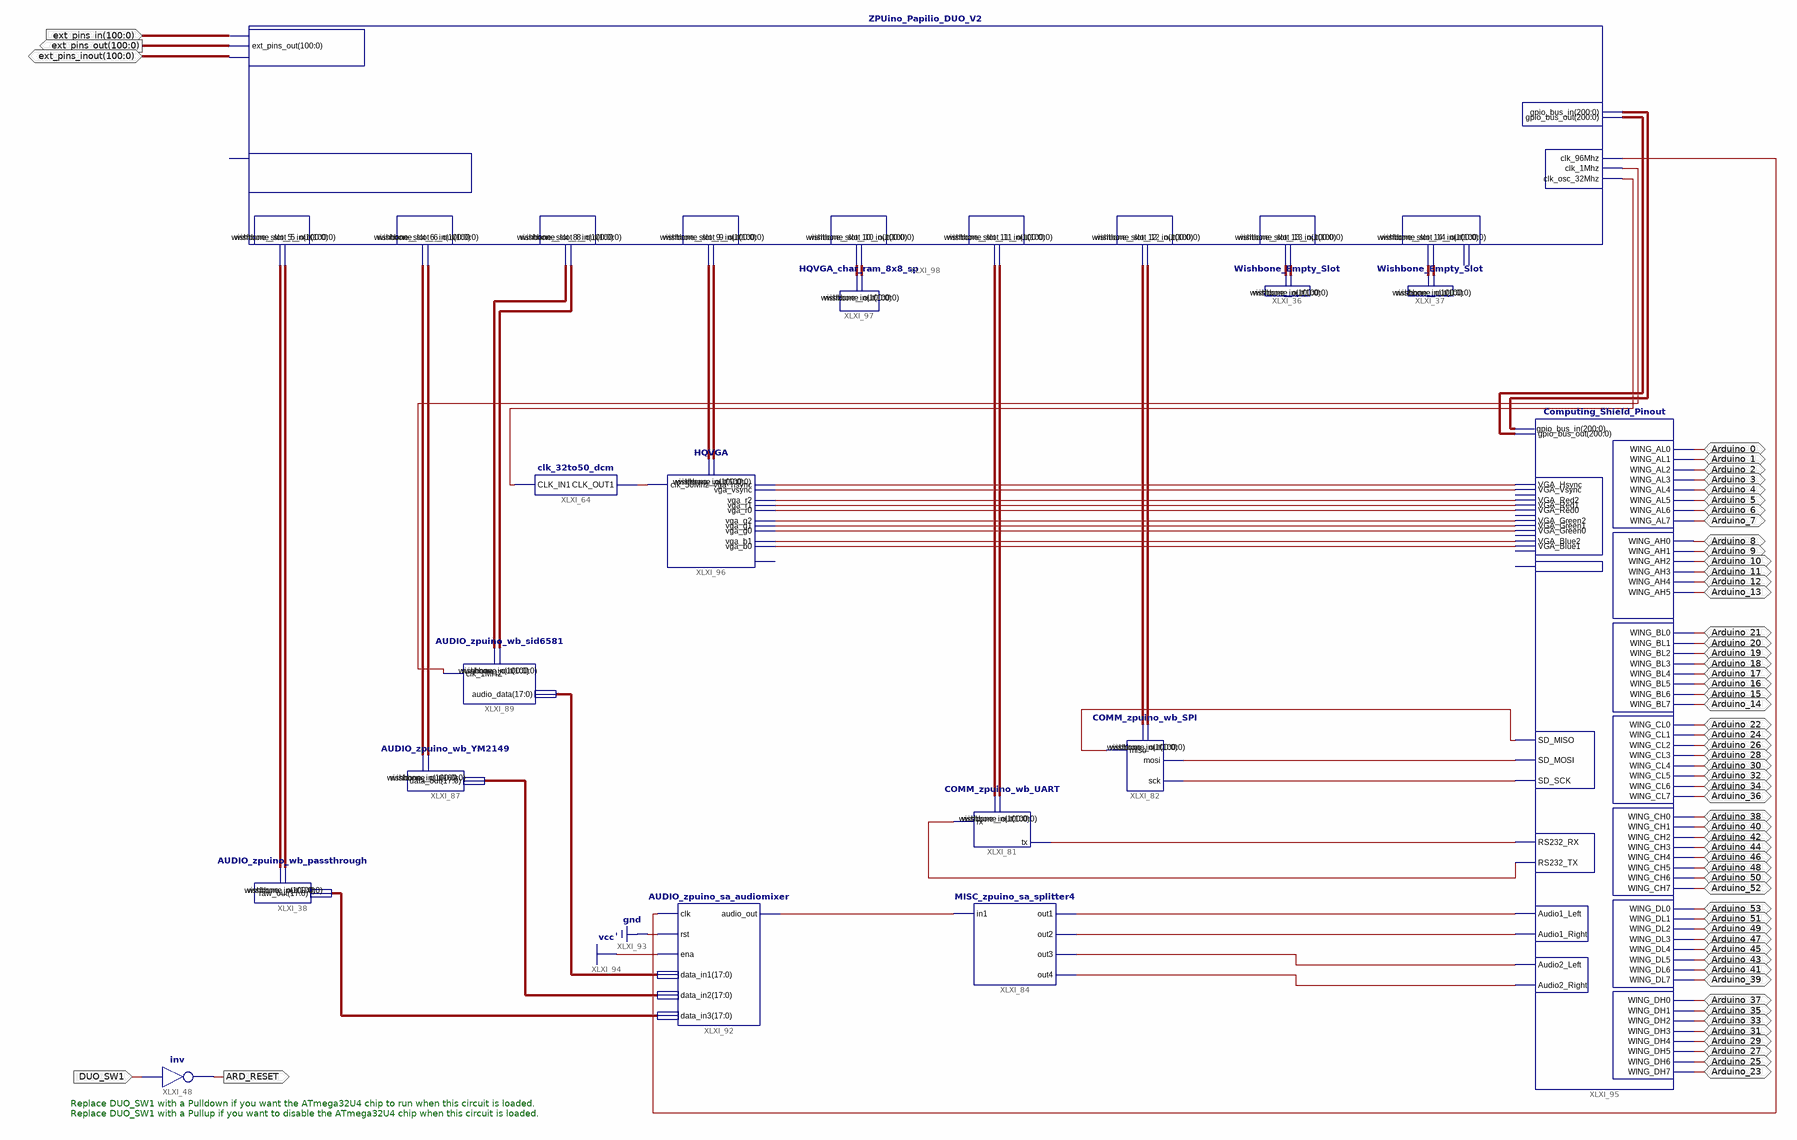
[diagram p0: schematic sheet 1]
// Xilinx ISE schematic Papilio_DUO_LX9.sch (spartan6) as structural Verilog: 15 symbols, 59 ports
module Papilio_DUO_LX9 (
  input  DUO_SW1,
  input  [100:0] ext_pins_in,
  inout  Arduino_0,
  inout  Arduino_1,
  inout  Arduino_2,
  inout  Arduino_3,
  inout  Arduino_4,
  inout  Arduino_5,
  inout  Arduino_6,
  inout  Arduino_7,
  inout  Arduino_8,
  inout  Arduino_9,
  inout  Arduino_10,
  inout  Arduino_11,
  inout  Arduino_12,
  inout  Arduino_13,
  inout  Arduino_21,
  inout  Arduino_20,
  inout  Arduino_19,
  inout  Arduino_18,
  inout  Arduino_17,
  inout  Arduino_16,
  inout  Arduino_15,
  inout  Arduino_14,
  inout  Arduino_22,
  inout  Arduino_24,
  inout  Arduino_26,
  inout  Arduino_28,
  inout  Arduino_30,
  inout  Arduino_32,
  inout  Arduino_34,
  inout  Arduino_36,
  inout  Arduino_38,
  inout  Arduino_40,
  inout  Arduino_42,
  inout  Arduino_44,
  inout  Arduino_46,
  inout  Arduino_48,
  inout  Arduino_50,
  inout  Arduino_52,
  inout  Arduino_53,
  inout  Arduino_51,
  inout  Arduino_49,
  inout  Arduino_47,
  inout  Arduino_45,
  inout  Arduino_43,
  inout  Arduino_41,
  inout  Arduino_39,
  inout  Arduino_37,
  inout  Arduino_35,
  inout  Arduino_33,
  inout  Arduino_31,
  inout  Arduino_29,
  inout  Arduino_27,
  inout  Arduino_25,
  inout  Arduino_23,
  inout  [100:0] ext_pins_inout,
  output ARD_RESET,
  output [100:0] ext_pins_out
);

  wire XLXN_549, XLXN_584, XLXN_585, XLXN_586, XLXN_587, XLXN_588, XLXN_589, XLXN_590, XLXN_591, XLXN_592,
       XLXN_593, XLXN_596, XLXN_629, XLXN_630, XLXN_633, XLXN_634, XLXN_635, XLXN_639, XLXN_640, XLXN_649,
       XLXN_653, XLXN_662, XLXN_665, XLXN_666;
  wire [17:0] XLXN_450, XLXN_650, XLXN_651;
  wire [100:0] XLXN_667, XLXN_668, XLXN_669, XLXN_670, XLXN_671, XLXN_672, XLXN_673, XLXN_674, XLXN_675,
       XLXN_676, XLXN_677, XLXN_678, XLXN_679, XLXN_680, XLXN_681, XLXN_682, XLXN_683, XLXN_684;
  wire [200:0] XLXN_408, XLXN_409;

  Wishbone_Empty_Slot XLXI_37 (.wishbone_in(XLXN_679), .wishbone_out(XLXN_680));
  Wishbone_Empty_Slot XLXI_36 (.wishbone_in(XLXN_677), .wishbone_out(XLXN_678));
  clk_32to50_dcm XLXI_64 (.CLK_IN1(XLXN_549), .CLK_OUT1(XLXN_596));
  AUDIO_zpuino_wb_passthrough XLXI_38 (.raw_out(XLXN_450), .wishbone_in(XLXN_669), .wishbone_out(XLXN_670));
  COMM_zpuino_wb_UART XLXI_81 (.rx(XLXN_630), .wishbone_in(XLXN_681), .wishbone_out(XLXN_682), .tx(XLXN_629));
  COMM_zpuino_wb_SPI XLXI_82 (
    .miso(XLXN_633), .sck(XLXN_635), .mosi(XLXN_634), .wishbone_in(XLXN_683), .wishbone_out(XLXN_684));
  MISC_zpuino_sa_splitter4 XLXI_84 (.in1(XLXN_653), .out1(XLXN_639), .out2(XLXN_640), .out3(XLXN_665), .out4(XLXN_666));
  AUDIO_zpuino_wb_YM2149 XLXI_87 (.data_out(XLXN_651), .wishbone_in(XLXN_671), .wishbone_out(XLXN_672));
  AUDIO_zpuino_wb_sid6581 XLXI_89 (
    .clk_1MHZ(XLXN_649), .audio_data(XLXN_650), .wishbone_in(XLXN_667), .wishbone_out(XLXN_668));
  AUDIO_zpuino_sa_audiomixer XLXI_92 (
    .clk(XLXN_662), .rst(1'b0), .ena(1'b1), .data_in1(XLXN_650), .data_in2(XLXN_651), .data_in3(XLXN_450),
    .audio_out(XLXN_653));
  Computing_Shield_Pinout XLXI_95 (
    .gpio_bus_out(XLXN_408), .gpio_bus_in(XLXN_409), .WING_AL0(Arduino_0), .WING_AL1(Arduino_1),
    .WING_AL2(Arduino_2), .WING_AL3(Arduino_3), .WING_AL4(Arduino_4), .WING_AL5(Arduino_5),
    .WING_AL6(Arduino_6), .WING_AL7(Arduino_7), .WING_AH0(Arduino_8), .WING_AH1(Arduino_9),
    .WING_AH2(Arduino_10), .WING_AH3(Arduino_11), .WING_AH4(Arduino_12), .WING_AH5(Arduino_13),
    .VGA_Red2(XLXN_586), .VGA_Red1(XLXN_587), .VGA_Red0(XLXN_588), .VGA_Green2(XLXN_589),
    .VGA_Green1(XLXN_590), .VGA_Green0(XLXN_591), .VGA_Hsync(XLXN_584), .VGA_Vsync(XLXN_585),
    .Audio1_Left(XLXN_639), .WING_CL0(Arduino_22), .WING_CL1(Arduino_24), .WING_CL2(Arduino_26),
    .WING_CL3(Arduino_28), .WING_CL4(Arduino_30), .WING_CL5(Arduino_32), .WING_CL6(Arduino_34),
    .WING_CL7(Arduino_36), .WING_CH0(Arduino_38), .WING_CH1(Arduino_40), .WING_CH2(Arduino_42),
    .WING_CH3(Arduino_44), .WING_CH4(Arduino_46), .WING_CH5(Arduino_48), .WING_CH6(Arduino_50),
    .WING_CH7(Arduino_52), .SD_MISO(XLXN_633), .SD_MOSI(XLXN_634), .RS232_RX(XLXN_629), .RS232_TX(XLXN_630),
    .SD_SCK(XLXN_635), .Audio1_Right(XLXN_640), .Audio2_Right(XLXN_666), .Audio2_Left(XLXN_665),
    .WING_BL0(Arduino_21), .WING_BL1(Arduino_20), .WING_BL2(Arduino_19), .WING_BL3(Arduino_18),
    .WING_BL4(Arduino_17), .WING_BL5(Arduino_16), .WING_BL6(Arduino_15), .WING_BL7(Arduino_14),
    .WING_DL0(Arduino_53), .WING_DL1(Arduino_51), .WING_DL2(Arduino_49), .WING_DL3(Arduino_47),
    .WING_DL4(Arduino_45), .WING_DL5(Arduino_43), .WING_DL6(Arduino_41), .WING_DL7(Arduino_39),
    .WING_DH0(Arduino_37), .WING_DH1(Arduino_35), .WING_DH2(Arduino_33), .WING_DH3(Arduino_31),
    .WING_DH4(Arduino_29), .WING_DH5(Arduino_27), .WING_DH6(Arduino_25), .WING_DH7(Arduino_23),
    .VGA_Blue1(XLXN_593), .VGA_Blue2(XLXN_592));  // open: VGA_Red3, VGA_Green3, VGA_Blue3, VGA_Blue0, VGA_Bus
  HQVGA XLXI_96 (
    .clk_50Mhz(XLXN_596), .vga_hsync(XLXN_584), .vga_vsync(XLXN_585), .vga_r2(XLXN_586), .vga_r1(XLXN_587),
    .vga_r0(XLXN_588), .vga_g2(XLXN_589), .vga_g1(XLXN_590), .vga_g0(XLXN_591), .vga_b1(XLXN_592),
    .vga_b0(XLXN_593), .wishbone_in(XLXN_675), .wishbone_out(XLXN_676));  // open: VGA_Bus
  HQVGA_char_ram_8x8_sp XLXI_97 (.wishbone_in(XLXN_673), .wishbone_out(XLXN_674));
  not XLXI_48 (ARD_RESET, DUO_SW1);
  ZPUino_Papilio_DUO_V2 XLXI_98 (
    .gpio_bus_out(XLXN_408), .gpio_bus_in(XLXN_409), .clk_96Mhz(XLXN_662), .clk_1Mhz(XLXN_649),
    .clk_osc_32Mhz(XLXN_549), .ext_pins_in(ext_pins_in), .ext_pins_out(ext_pins_out),
    .ext_pins_inout(ext_pins_inout), .wishbone_slot_5_out(XLXN_670), .wishbone_slot_5_in(XLXN_669),
    .wishbone_slot_6_in(XLXN_671), .wishbone_slot_6_out(XLXN_672), .wishbone_slot_8_in(XLXN_667),
    .wishbone_slot_8_out(XLXN_668), .wishbone_slot_9_in(XLXN_675), .wishbone_slot_9_out(XLXN_676),
    .wishbone_slot_10_in(XLXN_673), .wishbone_slot_10_out(XLXN_674), .wishbone_slot_11_in(XLXN_681),
    .wishbone_slot_11_out(XLXN_682), .wishbone_slot_12_in(XLXN_683), .wishbone_slot_12_out(XLXN_684),
    .wishbone_slot_13_in(XLXN_677), .wishbone_slot_13_out(XLXN_678), .wishbone_slot_14_in(XLXN_679),
    .wishbone_slot_14_out(XLXN_680));  // open: AVR_Wishbone_Bridge_Enable, wishbone_slot_video_in, wishbone_slot_video_out

  // Notes on the sheet:
  //   Replace DUO_SW1 with a Pulldown if you want the ATmega32U4 chip to run when this circuit is loaded.
  //   Replace DUO_SW1 with a Pullup if you want to disable the ATmega32U4 chip when this circuit is loaded.
endmodule
